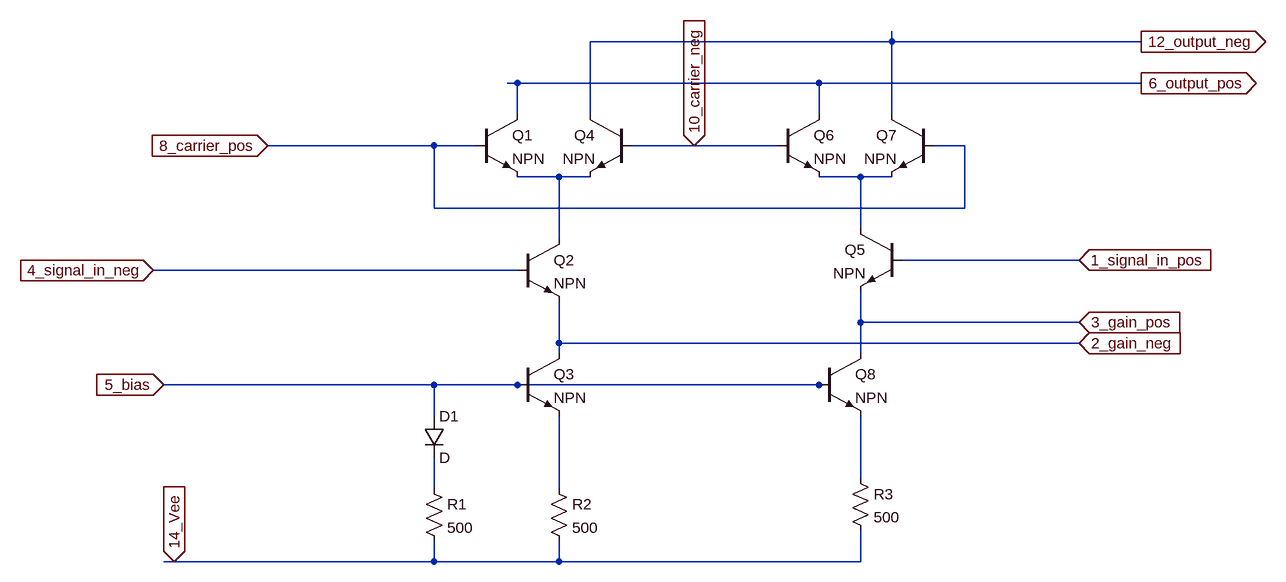
[diagram p0: schematic MC1496_schem.asc]
MC1496_schem.asc, the LTspice schematic file:
Version 4.1
SHEET 1 1308 836
WIRE 688 -48 688 -64
WIRE 688 -48 224 -48
WIRE 1072 -48 688 -48
WIRE 112 16 96 16
WIRE 576 16 112 16
WIRE 1072 16 576 16
WIRE 112 64 112 16
WIRE 224 64 224 -48
WIRE 576 64 576 16
WIRE 688 64 688 -48
WIRE -16 112 -272 112
WIRE 48 112 -16 112
WIRE 384 112 288 112
WIRE 512 112 384 112
WIRE 800 112 752 112
WIRE 176 160 112 160
WIRE 224 160 176 160
WIRE 640 160 576 160
WIRE 688 160 640 160
WIRE -16 208 -16 112
WIRE 800 208 800 112
WIRE 800 208 -16 208
WIRE 640 240 640 160
WIRE 176 256 176 160
WIRE 976 288 704 288
WIRE 112 304 -448 304
WIRE 640 384 640 336
WIRE 976 384 640 384
WIRE 176 416 176 352
WIRE 976 416 176 416
WIRE 176 432 176 416
WIRE 640 432 640 384
WIRE -16 480 -432 480
WIRE 112 480 -16 480
WIRE 576 480 112 480
WIRE 592 480 576 480
WIRE -16 528 -16 480
WIRE 640 624 640 528
WIRE -16 640 -16 592
WIRE 176 640 176 528
WIRE -416 752 -432 752
WIRE -16 752 -16 720
WIRE -16 752 -416 752
WIRE 176 752 176 720
WIRE 176 752 -16 752
WIRE 640 752 640 704
WIRE 640 752 176 752
FLAG 384 112 10_carrier_neg
IOPIN 384 112 In
FLAG -272 112 8_carrier_pos
IOPIN -272 112 In
FLAG 976 288 1_signal_in_pos
IOPIN 976 288 In
FLAG -448 304 4_signal_in_neg
IOPIN -448 304 In
FLAG -432 480 5_bias
IOPIN -432 480 In
FLAG -416 752 14_Vee
IOPIN -416 752 In
FLAG 1072 -48 12_output_neg
IOPIN 1072 -48 Out
FLAG 1072 16 6_output_pos
IOPIN 1072 16 Out
FLAG 976 384 3_gain_pos
IOPIN 976 384 In
FLAG 976 416 2_gain_neg
IOPIN 976 416 In
SYMBOL npn 48 64 R0
SYMATTR InstName Q1
SYMBOL npn 112 256 R0
SYMATTR InstName Q2
SYMBOL npn 112 432 R0
SYMATTR InstName Q3
SYMBOL diode -32 528 R0
SYMATTR InstName D1
SYMBOL res -32 624 R0
SYMATTR InstName R1
SYMATTR Value 500
SYMBOL res 160 624 R0
SYMATTR InstName R2
SYMATTR Value 500
SYMBOL npn 288 64 M0
SYMATTR InstName Q4
SYMBOL npn 704 240 M0
SYMATTR InstName Q5
SYMBOL npn 512 64 R0
SYMATTR InstName Q6
SYMBOL npn 752 64 M0
SYMATTR InstName Q7
SYMBOL npn 576 432 R0
SYMATTR InstName Q8
SYMBOL res 624 608 R0
SYMATTR InstName R3
SYMATTR Value 500

The netlist it stands for:
* MC1496_schem.asc
Q1 6_output_pos 8_carrier_pos N001 0 NPN
Q2 N001 4_signal_in_neg 2_gain_neg 0 NPN
Q3 2_gain_neg 5_bias N005 0 NPN
D1 5_bias N004 D
R1 N004 14_Vee 500
R2 N005 14_Vee 500
Q4 12_output_neg 10_carrier_neg N001 0 NPN
Q5 N002 1_signal_in_pos 3_gain_pos 0 NPN
Q6 6_output_pos 10_carrier_neg N002 0 NPN
Q7 12_output_neg 8_carrier_pos N002 0 NPN
Q8 3_gain_pos 5_bias N003 0 NPN
R3 N003 14_Vee 500
.model D D
.lib standard.dio
.model NPN NPN
.model PNP PNP
.lib standard.bjt
.backanno
.end